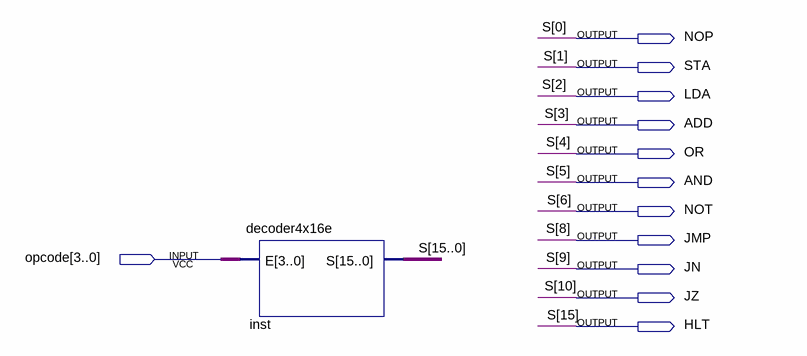
[diagram p0: schematic sheet]
// Quartus schematic decoder.bdf as structural Verilog: 1 symbols, 12 pins
module decoder (
  input  [3:0] opcode,
  output NOP,
  output STA,
  output LDA,
  output ADD,
  output OR,
  output AND,
  output NOT,
  output JMP,
  output JN,
  output JZ,
  output HLT
);

  wire [14:7] S;

  decoder4x16e inst (.E(opcode), .S({HLT, S[14:11], JZ, JN, JMP, S[7], NOT, AND, OR, ADD, LDA, STA, NOP}));

  // Other names for the same wires on the sheet: S (some bits) = {HLT, JZ, JN, JMP, NOT, AND, OR, ADD, LDA, STA, NOP}
endmodule
